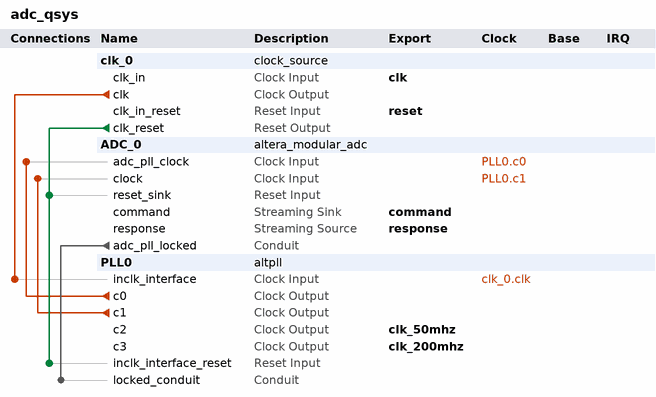
[diagram p0: system contents]
# Platform Designer (Qsys) system adc_qsys, MAX 10 10M08SAU169C8G
# Parameters at their usual value, and those the tool derives, are not listed.
package require -exact qsys 20.1
create_system adc_qsys
set_project_property DEVICE_FAMILY {MAX 10}
set_project_property DEVICE 10M08SAU169C8G

add_instance clk_0 clock_source 20.1
set_instance_parameter_value clk_0 clockFrequency 12000000

add_instance ADC_0 altera_modular_adc 20.1
set_instance_parameter_value ADC_0 CLOCK_FREQ 50000000
set_instance_parameter_value ADC_0 CORE_VAR 3
set_instance_parameter_value ADC_0 DEVICE_PART 10M08SAU169C8G
set_instance_parameter_value ADC_0 clkdiv 4
set_instance_parameter_value ADC_0 int_vref_vr 3.3
set_instance_parameter_value ADC_0 refsel 1
set_instance_parameter_value ADC_0 sample_rate 0
set_instance_parameter_value ADC_0 seq_order_length 1
set_instance_parameter_value ADC_0 seq_order_slot_1 30
set_instance_parameter_value ADC_0 seq_order_slot_2 30
set_instance_parameter_value ADC_0 seq_order_slot_3 30
set_instance_parameter_value ADC_0 seq_order_slot_4 30
set_instance_parameter_value ADC_0 seq_order_slot_5 30
set_instance_parameter_value ADC_0 seq_order_slot_6 30
set_instance_parameter_value ADC_0 seq_order_slot_7 30
set_instance_parameter_value ADC_0 use_ch0 true
set_instance_parameter_value ADC_0 use_ch2 true
set_instance_parameter_value ADC_0 use_ch3 true
set_instance_parameter_value ADC_0 use_ch4 false
set_instance_parameter_value ADC_0 use_ch5 true
set_instance_parameter_value ADC_0 use_ch6 false
set_instance_parameter_value ADC_0 use_ch7 true
set_instance_parameter_value ADC_0 use_ch8 true
set_instance_parameter_value ADC_0 use_tsd false

add_instance PLL0 altpll 20.1
set_instance_parameter_value PLL0 CLK0_DIVIDE_BY 3
set_instance_parameter_value PLL0 CLK0_MULTIPLY_BY 10
set_instance_parameter_value PLL0 CLK1_DIVIDE_BY 6
set_instance_parameter_value PLL0 CLK1_DUTY_CYCLE 50
set_instance_parameter_value PLL0 CLK1_MULTIPLY_BY 25
set_instance_parameter_value PLL0 CLK1_PHASE_SHIFT 0
set_instance_parameter_value PLL0 CLK2_DIVIDE_BY 6
set_instance_parameter_value PLL0 CLK2_DUTY_CYCLE 50
set_instance_parameter_value PLL0 CLK2_MULTIPLY_BY 25
set_instance_parameter_value PLL0 CLK2_PHASE_SHIFT 0
set_instance_parameter_value PLL0 CLK3_DIVIDE_BY 3
set_instance_parameter_value PLL0 CLK3_DUTY_CYCLE 50
set_instance_parameter_value PLL0 CLK3_MULTIPLY_BY 50
set_instance_parameter_value PLL0 CLK3_PHASE_SHIFT 0
set_instance_parameter_value PLL0 INCLK0_INPUT_FREQUENCY 83333
set_instance_parameter_value PLL0 PORT_ARESET PORT_UNUSED
set_instance_parameter_value PLL0 PORT_LOCKED PORT_USED
set_instance_parameter_value PLL0 PORT_clk1 PORT_USED
set_instance_parameter_value PLL0 PORT_clk2 PORT_USED
set_instance_parameter_value PLL0 PORT_clk3 PORT_USED

# connections
add_connection clk_0.clk PLL0.inclk_interface clock
add_connection PLL0.c0 ADC_0.adc_pll_clock clock
add_connection PLL0.c1 ADC_0.clock clock
add_connection clk_0.clk_reset ADC_0.reset_sink reset
add_connection clk_0.clk_reset PLL0.inclk_interface_reset reset
add_connection ADC_0.adc_pll_locked PLL0.locked_conduit conduit

# exported interfaces
add_interface clk clock sink
set_interface_property clk EXPORT_OF clk_0.clk_in
add_interface clk_200mhz clock source
set_interface_property clk_200mhz EXPORT_OF PLL0.c3
add_interface clk_50mhz clock source
set_interface_property clk_50mhz EXPORT_OF PLL0.c2
add_interface command avalon_streaming sink
set_interface_property command EXPORT_OF ADC_0.command
add_interface reset reset sink
set_interface_property reset EXPORT_OF clk_0.clk_in_reset
add_interface response avalon_streaming source
set_interface_property response EXPORT_OF ADC_0.response

set_interconnect_requirement {$system} qsys_mm.clockCrossingAdapter HANDSHAKE
set_interconnect_requirement {$system} qsys_mm.enableEccProtection FALSE
set_interconnect_requirement {$system} qsys_mm.insertDefaultSlave FALSE
set_interconnect_requirement {$system} qsys_mm.maxAdditionalLatency 1

save_system adc_qsys.qsys
